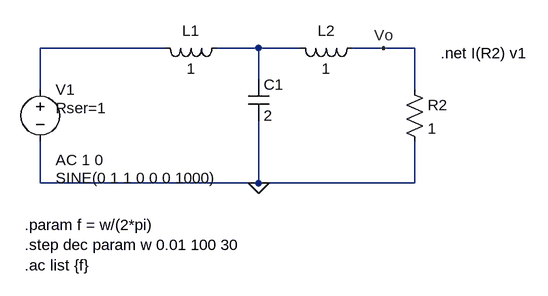
[diagram p0: schematic TS14_Rev1.asc]
TS14_Rev1.asc, the LTspice schematic file:
Version 4
SHEET 1 880 680
WIRE 176 112 -16 112
WIRE 320 112 256 112
WIRE 384 112 320 112
WIRE 512 112 464 112
WIRE 560 112 512 112
WIRE 320 160 320 112
WIRE -16 176 -16 112
WIRE 560 176 560 112
WIRE -16 320 -16 256
WIRE 320 320 320 224
WIRE 320 320 -16 320
WIRE 560 320 560 256
WIRE 560 320 320 320
FLAG 320 320 0
FLAG 512 112 Vo
SYMBOL ind 272 96 R90
WINDOW 0 5 56 VBottom 2
WINDOW 3 32 56 VTop 2
SYMATTR InstName L1
SYMATTR Value 1
SYMBOL cap 304 160 R0
SYMATTR InstName C1
SYMATTR Value 2
SYMBOL ind 480 96 R90
WINDOW 0 5 56 VBottom 2
WINDOW 3 32 56 VTop 2
SYMATTR InstName L2
SYMATTR Value 1
SYMBOL res 544 160 R0
SYMATTR InstName R2
SYMATTR Value 1
SYMBOL voltage -16 160 R0
WINDOW 3 24 152 Left 2
WINDOW 123 24 124 Left 2
WINDOW 39 24 44 Left 2
SYMATTR Value SINE(0 1 1 0 0 0 1000)
SYMATTR Value2 AC 1 0
SYMATTR SpiceLine Rser=1
SYMATTR InstName V1
TEXT 600 120 Left 2 !.net I(R2) v1
TEXT -40 384 Left 2 !.param f = w/(2*pi)\n.step dec param w 0.01 100 30\n.ac list {f}

The netlist it stands for:
* TS14_Rev1.asc
L1 N002 N001 1
C1 N002 0 2
L2 Vo N002 1
R2 Vo 0 1
V1 N001 0 SINE(0 1 1 0 0 0 1000) AC 1 0 Rser=1
.net I(R2) v1
.param f = w/(2*pi)
.step dec param w 0.01 100 30
.ac list {f}
.backanno
.end